# EAGLE design D8_schematic (EAGLE 9.6.2)
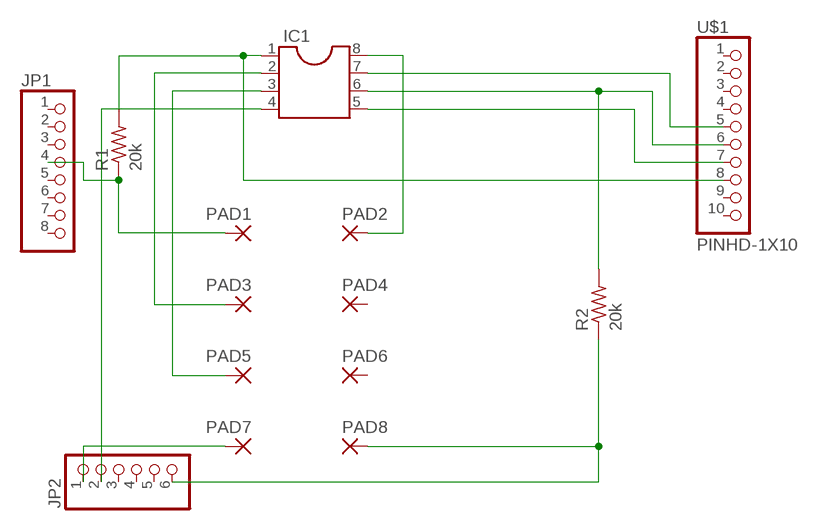
[diagram p0: schematic, sheet 1]

## Parts
IC1  DIL8S  [SOCKET-08]
JP1  PINHD-1X8-3.5MM  [1X08-3.5MM]
JP2  PINHD-1X6-3.5MM  [1X06-3.5MM]
PAD1  1,6/0,8  [1,6/0,8]
PAD2  1,6/0,8  [1,6/0,8]
PAD3  1,6/0,8  [1,6/0,8]
PAD4  1,6/0,8  [1,6/0,8]
PAD5  1,6/0,8  [1,6/0,8]
PAD6  1,6/0,8  [1,6/0,8]
PAD7  1,6/0,8  [1,6/0,8]
PAD8  1,6/0,8  [1,6/0,8]
R1  20k  R-US_0309/10  [0309/10]
R2  20k  R-US_0309/10  [0309/10]
U$1  PINHD-1X10  [1X10-BIG]

## Nets
N$1: IC1.8 PAD2.1(P)
N$2: IC1.6 R2.2 U$1.6
N$3: IC1.5 U$1.7
N$4: IC1.7 U$1.5
N$5: IC1.2 PAD3.1(P)
N$6: IC1.3 PAD5.1(P)
N$8: JP2.6 PAD8.1(P) R2.1
N$9: JP2.1 PAD7.1(P)
N$10: IC1.4 JP2.2
N$12: IC1.1 R1.2 U$1.8
N$13: JP1.4 PAD1.1(P) R1.1
Unconnected: JP1.1 JP1.2 JP1.3 JP1.5 JP1.6 JP1.7 JP1.8 JP2.3 JP2.4 JP2.5 PAD4.1(P) PAD6.1(P) U$1.1 U$1.2 U$1.3 U$1.4 U$1.9 U$1.10

## Library data of the parts
IC1 = ic-package:DIL8: Dual In Line / Socket
JP1 = adafruit:PINHD-1X8: PIN HEADER
JP2 = adafruit:PINHD-1X6: PIN HEADER
PAD1-PAD8 = wirepad:1,6/0,8: THROUGH-HOLE PAD
R1 R2 = rcl:R-US_: RESISTOR, American symbol; SPICEPREFIX: R
U$1 = adafruit:PINHD-1X10: Pin header 1x10 0.1" spacing With round pins

## Board
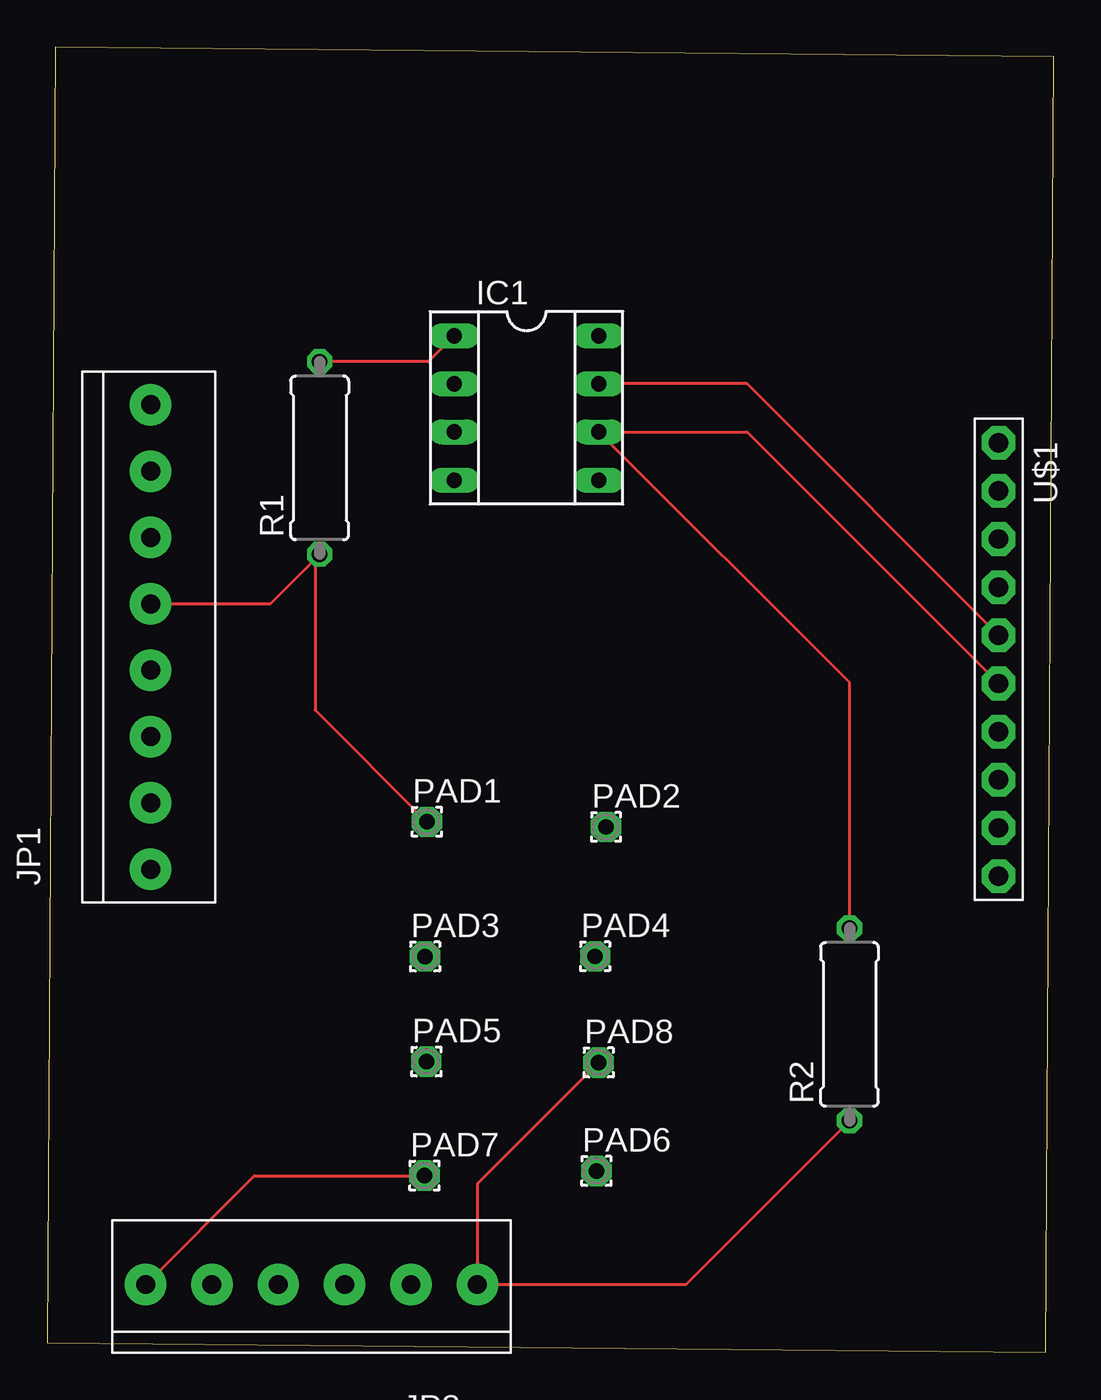
[diagram p1: board, top side]
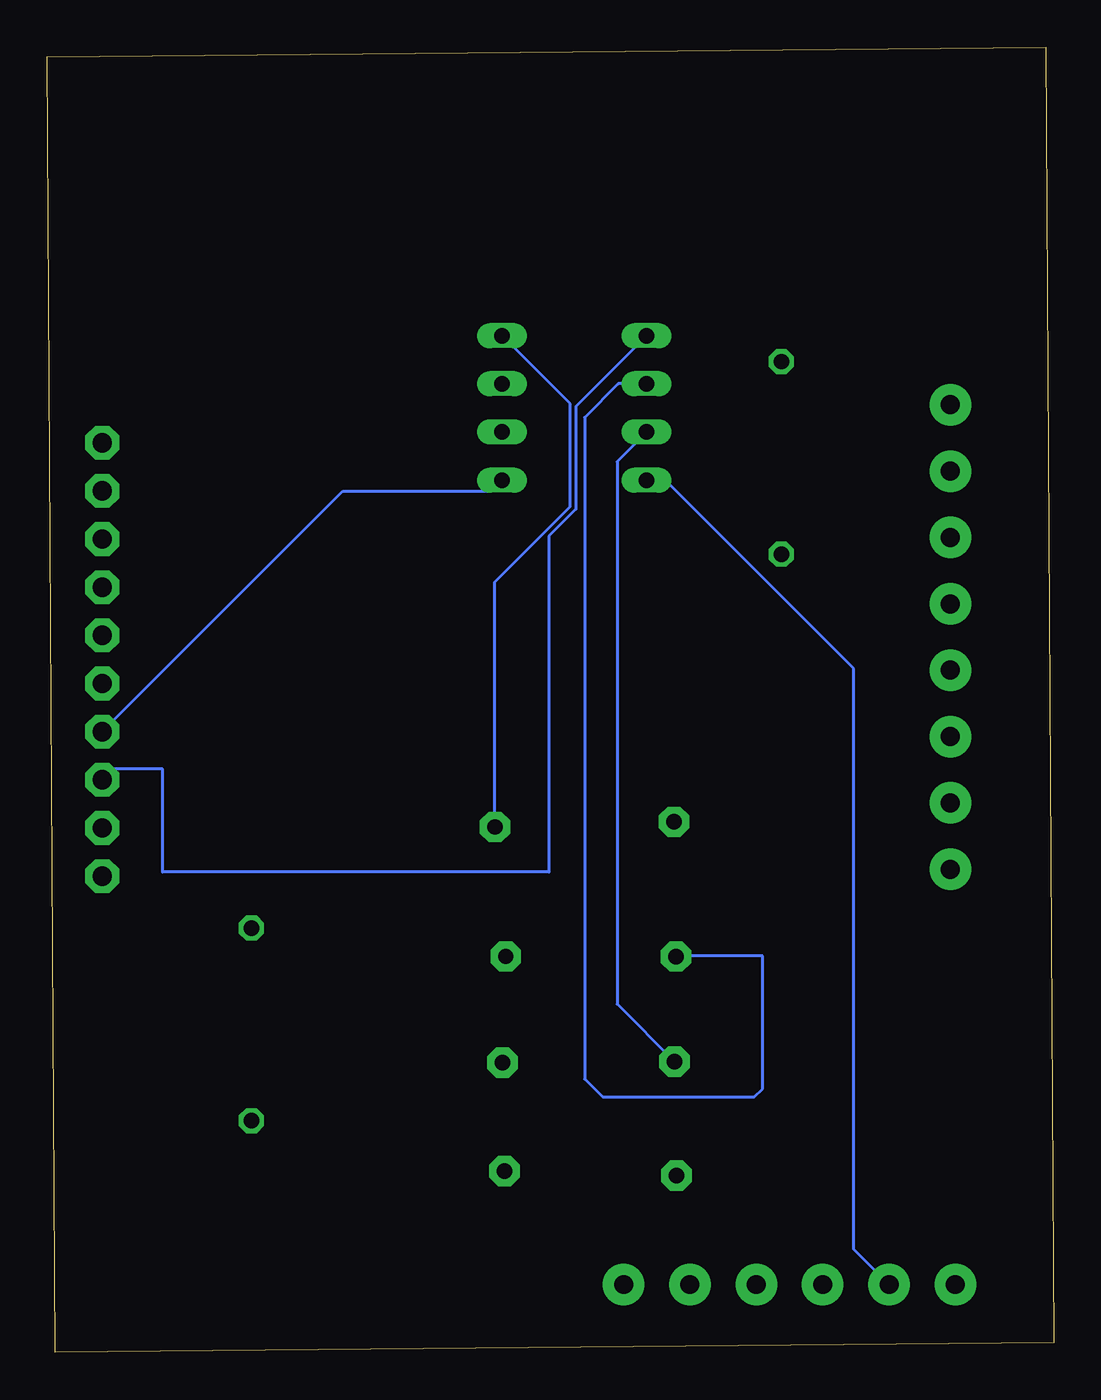
[diagram p2: board, bottom side, seen from below]

Size 53.06 x 68.83 mm. Coordinates in mm from the lower left corner, seen from the top.
Outline: 0,0.5 52.64,0 53.06,68.33 0.42,68.83 0,0.5
Copper layers (1*16): Top 0.035mm / dielectric 1.5mm / Bottom 0.035mm
Design rules "default": minimum track width 6mil, minimum drill 0.35mm, track to track 6mil, track to pad 6mil, pad to pad 6mil, via to via 6mil, smd to smd 6mil, copper to edge 40mil, drill to drill 6mil, minimum pad ring 10mil, minimum via ring 8mil, stop-mask expansion 4mil, vias tented up to drill 0mil, thermal gap 10mil

### Footprints (pad centres in the part's own frame; a part is rotated, then mirrored left to right if it is on the bottom)
SOCKET-08 = drill 0.813 long: 1 -3.81,-3.81; 2 -1.27,-3.81; 3 1.27,-3.81; 4 3.81,-3.81; 5 3.81,3.81; 6 1.27,3.81; 7 -1.27,3.81; 8 -3.81,3.81
1X08-3.5MM = drill 1 pad 2.184: 1 -12.25,0; 2 -8.75,0; 3 -5.25,0; 4 -1.75,0; 5 1.75,0; 6 5.25,0; 7 8.75,0; 8 12.25,0
1X06-3.5MM = drill 1 pad 2.184: 1 -8.75,0; 2 -5.25,0; 3 -1.75,0; 4 1.75,0; 5 5.25,0; 6 8.75,0
1,6/0,8 = drill 0.813 pad 1.6 octagon: 1 0,0
0309/10 = drill 0.813 octagon: 1 -5.08,0; 2 5.08,0
1X10-BIG = drill 1.016 pad 1.778 octagon: 1 -11.43,0; 2 -8.89,0; 3 -6.35,0; 4 -3.81,0; 5 -1.27,0; 6 1.27,0; 7 3.81,0; 8 6.35,0; 9 8.89,0; 10 11.43,0

### Placement (x,y rotation side)
IC1  25.27,49.81 270 top
JP1  5.44,37.72 270 top
JP2  13.92,3.56 0 top
PAD1  20.01,27.97 0 top
PAD2  29.46,27.7 0 top
PAD3  19.92,20.87 0 top
PAD4  28.89,20.87 0 top
PAD5  19.98,15.32 0 top
PAD6  28.95,9.56 0 top
PAD7  19.88,9.3 0 top
PAD8  29.07,15.28 0 top
R1  14.36,47.17 90 top
R2  42.3,17.29 90 top
U$1  50.16,36.54 270 top

### Tracks (layer width: path | path; a pad name or v marks a point on that pad's centre or on a via)
N$1
  Bottom 0.152: PAD2.1 29.46,40.63 25.49,44.6 25.49,50.03 IC1.8
N$2
  Top 0.152: R2.2 42.3,35.32 IC1.6 36.9,48.54 U$1.6
N$3
  Bottom 0.152: U$1.7 37.48,45.42 29.66,45.42 IC1.5
N$4
  Top 0.152: U$1.5 36.9,51.08 IC1.7
N$5
  Bottom 0.152: IC1.2 22.95,51.08 24.72,49.3 24.72,14.41 23.79,13.47 15.77,13.47 15.34,13.9 15.34,20.89 19.9,20.89 PAD3.1
N$6
  Bottom 0.152: IC1.3 23.02,46.98 23.02,18.36 PAD5.1
N$8
  Top 0.152: PAD8.1 22.67,8.89 JP2.6 33.66,3.56 R2.1
N$9
  Top 0.152: JP2.1 10.91,9.3 PAD7.1
N$10
  Bottom 0.152: JP2.2 10.54,5.43 10.54,36.06 20.49,46 IC1.4
N$12
  Top 0.152: IC1.1 20.09,52.25 R1.2
  Bottom 0.152: IC1.1 25.18,49.89 25.18,44.47 26.61,43.04 26.61,25.32 46.98,25.32 46.98,30.75 49.6,30.75 U$1.8
N$13
  Top 0.152: R1.1 14.11,41.85 | 14.11,41.85 11.74,39.47 JP1.4 | 14.11,41.85 14.11,33.87 PAD1.1